# EAGLE schematic neural_network (EAGLE 9.0.0)
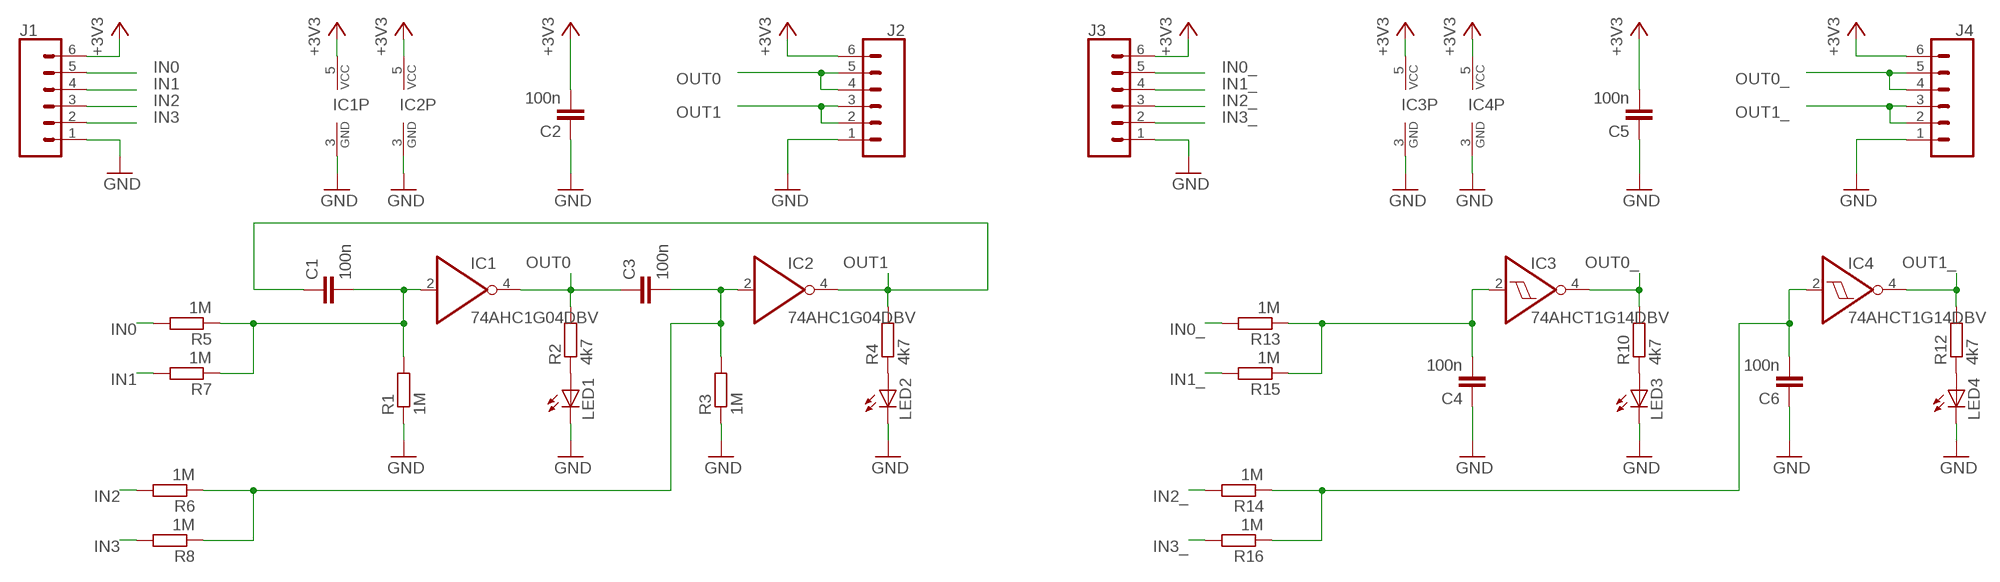
[diagram p0: schematic, sheet 1]

## Parts
C1  100n  C-EUC0805  [C0805]
C2  100n  C-EUC0805  [C0805]
C3  100n  C-EUC0805  [C0805]
C4  100n  C-EUC0805  [C0805]
C5  100n  C-EUC0805  [C0805]
C6  100n  C-EUC0805  [C0805]
IC1  74AHC1G04DBV  [SOT23-5]
IC2  74AHC1G04DBV  [SOT23-5]
IC3  74AHCT1G14DBV  [SOT23-5]
IC4  74AHCT1G14DBV  [SOT23-5]
J1  CONN_06LONGPADS  [1X06_LONGPADS]
J2  CONN_06LONGPADS  [1X06_LONGPADS]
J3  CONN_06LONGPADS  [1X06_LONGPADS]
J4  CONN_06LONGPADS  [1X06_LONGPADS]
LED1  LEDCHIPLED_1206  [CHIPLED_1206]
LED2  LEDCHIPLED_1206  [CHIPLED_1206]
LED3  LEDCHIPLED_1206  [CHIPLED_1206]
LED4  LEDCHIPLED_1206  [CHIPLED_1206]
R1  1M  R-EU_M0805  [M0805]
R2  4k7  R-EU_M0805  [M0805]
R3  1M  R-EU_M0805  [M0805]
R4  4k7  R-EU_M0805  [M0805]
R5  1M  R-EU_M0805  [M0805]
R6  1M  R-EU_M0805  [M0805]
R7  1M  R-EU_M0805  [M0805]
R8  1M  R-EU_M0805  [M0805]
R10  4k7  R-EU_M0805  [M0805]
R12  4k7  R-EU_M0805  [M0805]
R13  1M  R-EU_M0805  [M0805]
R14  1M  R-EU_M0805  [M0805]
R15  1M  R-EU_M0805  [M0805]
R16  1M  R-EU_M0805  [M0805]

## Nets
+3V3: C2.2 C5.2 IC1.5(VCC) IC2.5(VCC) IC3.5(VCC) IC4.5(VCC) J1.6 J2.6 J3.6 J4.6
GND: C2.1 C4.1 C5.1 C6.1 IC1.3(GND) IC2.3(GND) IC3.3(GND) IC4.3(GND) J1.1 J2.1 J3.1 J4.1 LED1.C LED2.C LED3.C LED4.C R1.1 R3.1
IN0: J1.5 R5.2
IN0_: J3.5 R13.2
IN1: J1.4 R7.2
IN1_: J3.4 R15.2
IN2: J1.3 R6.2
IN2_: J3.3 R14.2
IN3: J1.2 R8.2
IN3_: J3.2 R16.2
N$1: C1.2 IC1.2(I) R1.2 R5.1 R7.1
N$2: C4.2 IC3.2(I) R13.1 R15.1
N$3: LED3.A R10.1
N$4: C3.2 IC2.2(I) R3.2 R6.1 R8.1
N$5: LED1.A R2.1
N$6: C6.2 IC4.2(I) R14.1 R16.1
N$7: LED4.A R12.1
N$8: LED2.A R4.1
OUT0: C3.1 IC1.4(O) J2.4 J2.5 R2.2
OUT0_: IC3.4(O) J4.4 J4.5 R10.2
OUT1: C1.1 IC2.4(O) J2.2 J2.3 R4.2
OUT1_: IC4.4(O) J4.2 J4.3 R12.2

## Library data of the parts
C1-C6 = resistor:C-EU: CAPACITOR, European symbol
IC1 IC2 = 74xx-little-de:74*1G04: INVERTER Gate
IC3 IC4 = 74xx-little-de:74*1G14: Single Schmitt-Trigger Inverter Gate
J1-J4 = SparkFun-Connectors:CONN_06: Multi connection point. Often used as Generic Header-pin footprint for 0.1 inch spaced/style header connections On any of the 0.1 inch spaced packages, you can populate with these: Break Away Headers - Straight <https://www.sparkfun.com/products/116> (PRT-00116) Break Away Male Headers - Right Angle <https://www.sparkfun.com/products/553> (PRT-00553) Female Headers <https://www.sparkfun.com/products/115> (PRT-00115) Break Away Headers - Machine Pin <https://www.sparkfun.com/products/117> (PRT-00117) Break Away Female Headers - Swiss Machine Pin <https://www.sparkfun.com/products/743> (PRT-00743) Arduino Stackable Header - 6 Pin <https://www.sparkfun.com/products/9280> (PRT-09280) For SCREWTERMINALS and SPRING TERMINALS visit here: Screw Terimnals on SparkFun.com <https://www.sparkfun.com/search/results?term=Screw+Terminals> (5mm/3.5mm/2.54mm spacing) This device is also useful as a general connection point to wire up your design to another part of your project. Our various solder wires solder well into these plated through hole pads. Hook-Up Wire - Assortment (Stranded, 22 AWG) <https://www.sparkfun.com/products/11375> (PRT-11375) Hook-Up Wire - Assortment (Solid Core, 22 AWG) <https://www.sparkfun.com/products/11367> (PRT-11367) View the entire wire category on our website here <https://www.sparkfun.com/categories/141>
LED1-LED4 = led:LED: LED OSRAM: - CHIPLED LG R971, LG N971, LY N971, LG Q971, LY Q971, LO R971, LY R971 LH N974, LH R974 LS Q976, LO Q976, LY Q976 LO Q996 - Hyper CHIPLED LW Q18S LB Q993, LB Q99A, LB R99A - SideLED LS A670, LO A670, LY A670, LG A670, LP A670 LB A673, LV A673, LT A673, LW A673 LH A674 LY A675 LS A676, LA A676, LO A676, LY A676, LW A676 LS A679, LY A679, LG A679 - Hyper Micro SIDELED® LS Y876, LA Y876, LO Y876, LY Y876 LT Y87S - SmartLED LW L88C, LW L88S LB L89C, LB L89S, LG L890 LS L89K, LO L89K, LY L89K LS L896, LA L896, LO L896, LY L896 - TOPLED LS T670, LO T670, LY T670, LG T670, LP T670 LSG T670, LSP T670, LSY T670, LOP T670, LYG T670 LG T671, LOG T671, LSG T671 LB T673, LV T673, LT T673, LW T673 LH T674 LS T676, LA T676, LO T676, LY T676, LB T676, LH T676, LSB T676, LW T676 LB T67C, LV T67C, LT T67C, LS T67K, LO T67K, LY T67K, LW E67C LS E67B, LA E67B, LO E67B, LY E67B, LB E67C, LV E67C, LT E67C LW T67C LS T679, LY T679, LG T679 LS T770, LO T770, LY T770, LG T770, LP T770 LB T773, LV T773, LT T773, LW T773 LH T774 LS E675, LA E675, LY E675, LS T675 LS T776, LA T776, LO T776, LY T776, LB T776 LHGB T686 LT T68C, LB T68C - Hyper Mini TOPLED® LB M676 - Mini TOPLED Santana® LG M470 LS M47K, LO M47K, LY M47K Source: http://www.osram.convergy.de LUXEON: - LUMILED® LXK2-PW12-R00, LXK2-PW12-S00, LXK2-PW14-U00, LXK2-PW14-V00 LXK2-PM12-R00, LXK2-PM12-S00, LXK2-PM14-U00 LXK2-PE12-Q00, LXK2-PE12-R00, LXK2-PE12-S00, LXK2-PE14-T00, LXK2-PE14-U00 LXK2-PB12-K00, LXK2-PB12-L00, LXK2-PB12-M00, LXK2-PB14-N00, LXK2-PB14-P00, LXK2-PB14-Q00 LXK2-PR12-L00, LXK2-PR12-M00, LXK2-PR14-Q00, LXK2-PR14-R00 LXK2-PD12-Q00, LXK2-PD12-R00, LXK2-PD12-S00 LXK2-PH12-R00, LXK2-PH12-S00 LXK2-PL12-P00, LXK2-PL12-Q00, LXK2-PL12-R00 Source: www.luxeon.com KINGBRIGHT: KA-3528ASYC Source: www.kingbright.com
R1-R8 R10 R12-R16 = resistor:R-EU_: RESISTOR, European symbol